# Altium project photodetector.PrjPcb
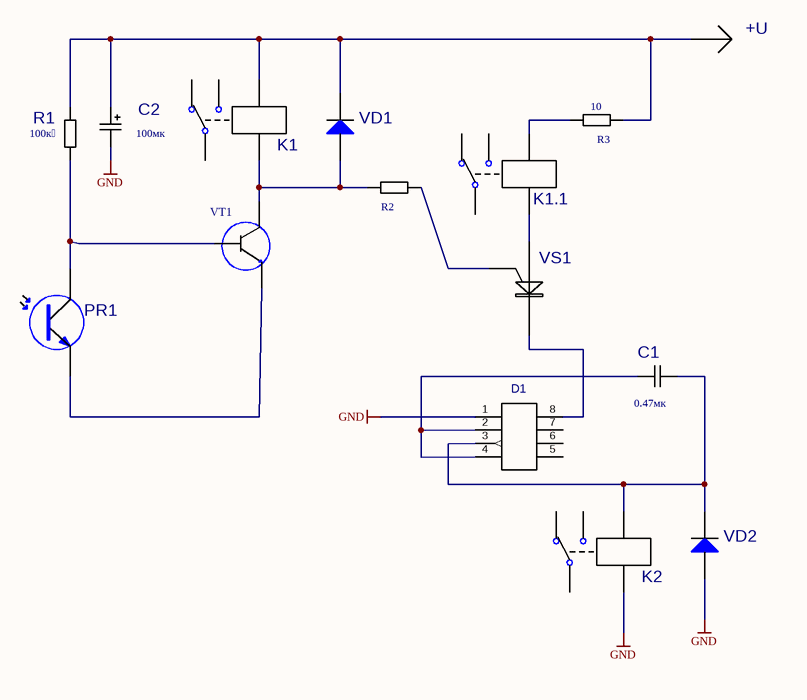
[diagram p0: Sheet1.SCHDOC]
1 sheet, 15 parts. Net scope: global (net labels, ports and power ports of the same name join across sheets).

## Sheet Sheet1.SCHDOC
size 279 x 215 mm; SheetNumber: 1; SheetTotal: 1; DocumentName: Sheet1.SCHDOC

### Parts
+U  PLUG  [PIN1]  (value not drawn)
C1  value 0.47мк  [RAD-0.3]  (hidden comment: CAP)
C2  value 100мк  [RB7.6-15]  (hidden comment: CAP_POL1)
D1  KP1006ВИ1  [KP1006ВИ1]  (value not drawn)
K1  RELAY-SPDT  [DIP-P5/X1.65]  (value not drawn)
K1.1  RELAY-SPDT  [DIP-P5/X1.65]  (value not drawn)
K2  RELAY-SPDT  [DIP-P5/X1.65]  (value not drawn)
PR1  PHOTO_NPN  [SFM-T2(3)/X1.6V]  (value not drawn)
R1  value 100к  [AXIAL-0.4]  (hidden comment: RES2)
R2  RES2  [AXIAL-0.4]  (value not drawn)
R3  value 10  [AXIAL-0.4]  (hidden comment: RES2)
VD1  DIODE_1N914  [DIO7.1-3.9X1.9]  (value not drawn)
VD2  DIODE_1N914  [DIO7.1-3.9X1.9]  (value not drawn)
VS1  PUT  (value not drawn)
VT1  КТ315  [КТ315]  (value not drawn)

### Nets
GND: C2.2 D1.1 K2.4 VD2.1(A)
Net+U_1: +U.1 C2.1 K1.5 R1.2 R3.2 VD1.2(K)
NetC1_1: C1.1 D1.2 D1.4
NetC1_2: C1.2 D1.3 K2.5 VD2.2(K)
NetD1_8: D1.8 VS1.3(K)
NetK1.1_4: K1.1.4 VS1.1(A)
NetK1.1_5: K1.1.5 R3.1
NetK1_4: K1.4 R2.1 VD1.1(A) VT1.K
NetPR1_1: PR1.1(C) R1.1 VT1.B
NetPR1_3: PR1.3(E) VT1.E
NetR2_2: R2.2 VS1.2(G)

Not connected (* = marked no-connect by the designer): D1 5 6 7; K1 1 2 3; K1.1 1 2 3; K2 1 2 3

### Library data of the parts
R2 = RES2: Value: 1K; Published: 8-Jun-2000; LatestRevisionDate: 17-Jul-2002; LatestRevisionNote: Re-released for DXP Platform.; Publisher: Altium Limited
VD1 VD2 = DIODE_1N914: ComponentLink1DescBC: Manufacturer Link; Value: *; Published: 8-Jun-2000; LatestRevisionDate: 17-Jul-2002; LatestRevisionNote: Re-released for DXP Platform.; DatasheetDocument: 1997; PackageReference: DO-35; Publisher: Altium Limited; Code_JEDEC: DO-204-AH; ComponentLink1URL: http://www.fairchildsemi.com/
VS1 = PUT: Programmable Unijunction Transistor; ComponentField6: Published 8-Jun-2000; OriginalName: PUT
+U = PLUG: Value: *; LatestRevisionDate: 17-Jul-2002; LatestRevisionNote: Re-released for DXP Platform.; Publisher: Altium Limited
C1 = CAP: Published: 8-Jun-2000; LatestRevisionDate: 17-Jul-2002; LatestRevisionNote: Re-released for DXP Platform.; Publisher: Altium Limited
C2 = CAP_POL1: Published: 8-Jun-2000; LatestRevisionDate: 17-Jul-2002; LatestRevisionNote: Re-released for DXP Platform.; Publisher: Altium Limited
D1 = KP1006ВИ1: Value: *
K1 K1.1 K2 = RELAY-SPDT: Value: *; Published: 24-Mar-1999; LatestRevisionDate: 17-Jul-2002; LatestRevisionNote: Re-released for DXP Platform.; Publisher: Altium Limited
PR1 = PHOTO_NPN: Value: *; Published: 24-Mar-1999; LatestRevisionDate: 17-Jul-2002; LatestRevisionNote: Re-released for DXP Platform.; Publisher: Altium Limited; Code_JEDEC: TO-220-AC
R1 R3 = RES2: Published: 8-Jun-2000; LatestRevisionDate: 17-Jul-2002; LatestRevisionNote: Re-released for DXP Platform.; Publisher: Altium Limited
VT1 = КТ315: Value: *